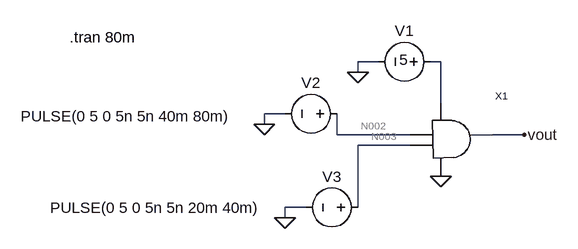
[diagram p0: schematic cmos_andtb.asc]
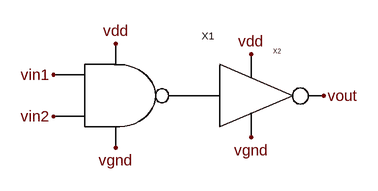
[diagram p1: sub-circuit cmos_and.asc]
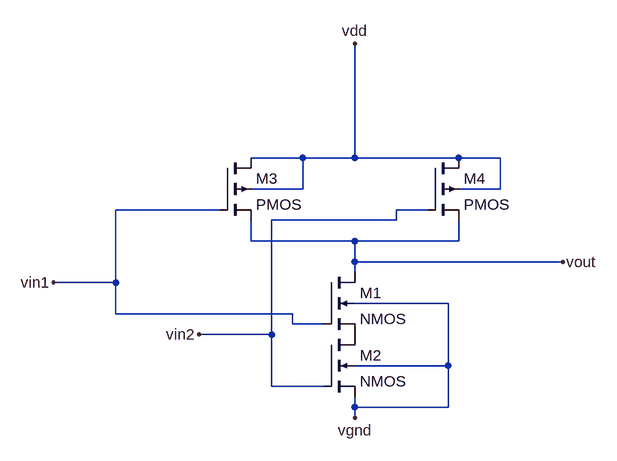
[diagram p2: sub-circuit cmos_nand.asc]
cmos_andtb.asc, the LTspice schematic file:
Version 4
SHEET 1 880 680
WIRE 80 48 48 48
WIRE 176 48 160 48
WIRE 48 64 48 48
WIRE 176 112 176 48
WIRE -64 128 -96 128
WIRE -96 144 -96 128
WIRE 16 160 16 128
WIRE 128 160 16 160
WIRE 304 160 256 160
WIRE 128 176 48 176
WIRE -32 272 -64 272
WIRE 48 272 48 176
WIRE -64 288 -64 272
FLAG 176 224 0
FLAG 48 64 0
FLAG -96 144 0
FLAG -64 288 0
FLAG 304 160 vout
SYMBOL cmos_and 192 176 R0
SYMATTR InstName X1
SYMBOL voltage 176 48 R90
WINDOW 0 -32 56 VBottom 2
WINDOW 3 12 57 VBottom 2
WINDOW 123 0 0 Left 0
WINDOW 39 0 0 Left 0
SYMATTR InstName V1
SYMATTR Value 5
SYMBOL voltage 32 128 R90
WINDOW 0 -32 56 VBottom 2
WINDOW 3 -12 341 VTop 2
WINDOW 123 0 0 Left 0
WINDOW 39 0 0 Left 0
SYMATTR InstName V2
SYMATTR Value PULSE(0 5 0 5n 5n 40m 80m)
SYMBOL voltage 64 272 R90
WINDOW 0 -32 56 VBottom 2
WINDOW 3 -15 328 VTop 2
WINDOW 123 0 0 Left 0
WINDOW 39 0 0 Left 0
SYMATTR InstName V3
SYMATTR Value PULSE(0 5 0 5n 5n 20m 40m)
TEXT -396 10 Left 2 !.tran 80m

cmos_and.asc, the sub-circuit schematic file:
Version 4
SHEET 1 880 680
FLAG 16 128 vin1
FLAG 16 192 vin2
FLAG 112 80 vdd
FLAG 112 240 vgnd
FLAG 320 96 vdd
FLAG 320 224 vgnd
FLAG 432 160 vout
SYMBOL cmos_nand 112 160 R0
SYMATTR InstName X1
SYMBOL inverter 320 160 R0
SYMATTR InstName X2

cmos_nand.asc, the sub-circuit schematic file:
Version 4
SHEET 1 880 680
WIRE 112 -96 32 -96
WIRE 192 -96 192 -272
WIRE 192 -96 112 -96
WIRE 352 -96 192 -96
WIRE 416 -96 352 -96
WIRE 112 -48 112 -96
WIRE 112 -48 32 -48
WIRE 416 -48 416 -96
WIRE 416 -48 352 -48
WIRE -16 -16 -176 -16
WIRE 304 -16 256 -16
WIRE 256 0 256 -16
WIRE 256 0 64 0
WIRE 32 32 32 0
WIRE 192 32 32 32
WIRE 352 32 352 0
WIRE 352 32 192 32
WIRE 192 64 192 32
WIRE 512 64 192 64
WIRE 192 80 192 64
WIRE -176 96 -176 -16
WIRE -176 96 -272 96
WIRE 336 128 192 128
WIRE -176 144 -176 96
WIRE 96 144 -176 144
WIRE 96 160 96 144
WIRE 144 160 96 160
WIRE 64 176 64 0
WIRE 64 176 -48 176
WIRE 336 224 336 128
WIRE 336 224 192 224
WIRE 64 256 64 176
WIRE 144 256 64 256
WIRE 192 288 192 272
WIRE 336 288 336 224
WIRE 336 288 192 288
WIRE 192 304 192 288
FLAG 512 64 vout
FLAG 192 -272 vdd
FLAG -272 96 vin1
FLAG -48 176 vin2
FLAG 192 304 vgnd
SYMBOL nmos4 144 80 R0
SYMATTR InstName M1
SYMBOL nmos4 144 176 R0
SYMATTR InstName M2
SYMBOL pmos4 -16 -96 R0
SYMATTR InstName M3
SYMBOL pmos4 304 -96 R0
SYMATTR InstName M4

The netlist it stands for:
* cmos_andtb.asc
XX1 N002 N003 N001 0 vout cmos_and
V1 N001 0 5
V2 N002 0 PULSE(0 5 0 5n 5n 40m 80m)
V3 N003 0 PULSE(0 5 0 5n 5n 20m 40m)

* block symbol definitions
.subckt cmos_and vin1 vin2 vdd vgnd vout
XX1 vin1 vin2 P001 vdd vgnd cmos_nand
XX2 P001 vdd vgnd vout inverter  ; pins vin vdd vg vout
.ends cmos_and

.subckt cmos_nand vin1 vin2 vout vdd vgnd
M1 vout vin1 P001 vgnd NMOS
M2 P001 vin2 vgnd vgnd NMOS
M3 vdd vin1 vout vdd PMOS
M4 vdd vin2 vout vdd PMOS
.ends cmos_nand

.model NMOS NMOS
.model PMOS PMOS
.lib standard.mos
.tran 80m
.backanno
.end

* Results of the author's LTspice run, read from the files saved beside the schematic
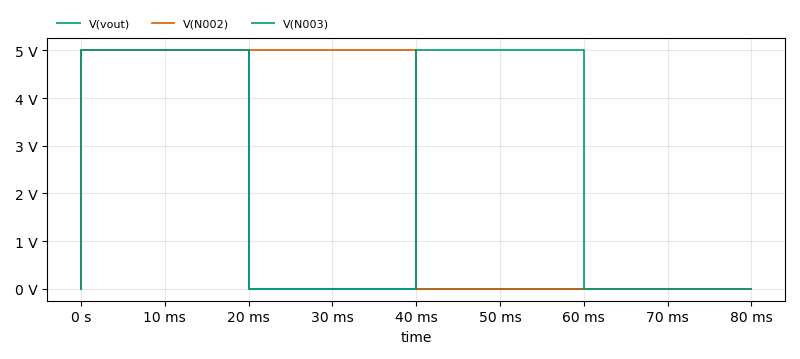
[diagram p3: Transient Analysis of cmos_andtb.asc, plotted from the saved traces]
* Transient Analysis, 1 run:
*   V(vout): min 0 V, max 5 V, average 1.25 V, rms 2.5 V, last 0 V
*   V(N002): min 0 V, max 5 V, average 2.5 V, rms 3.536 V, last 0 V
*   V(N003): min 0 V, max 5 V, average 2.5 V, rms 3.536 V, last 0 V